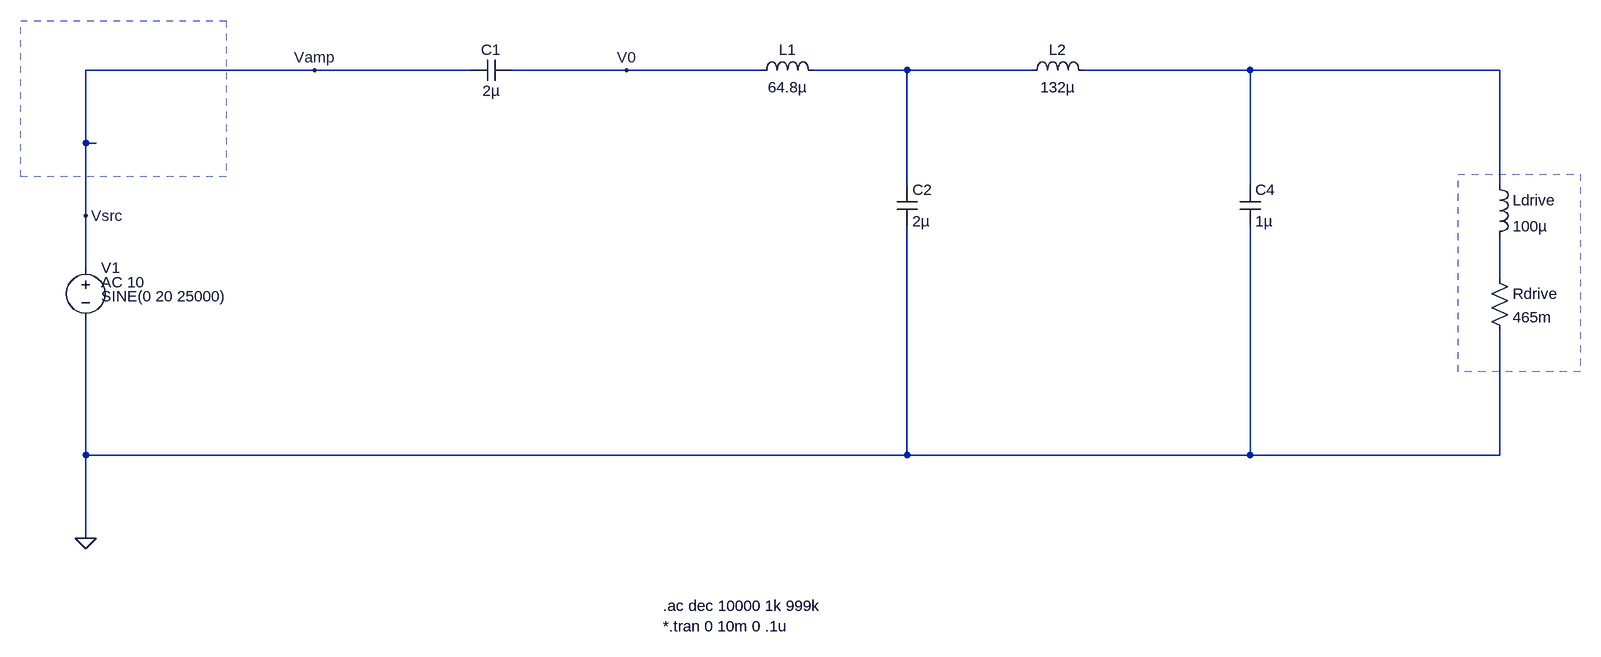
[diagram p0: schematic Tx_Filter_MPSv2_v2.asc]
Tx_Filter_MPSv2_v2.asc, the LTspice schematic file:
Version 4
SHEET 1 2128 1188
WIRE 176 64 -176 64
WIRE 416 64 176 64
WIRE 656 64 480 64
WIRE 864 64 656 64
WIRE 1088 64 944 64
WIRE 1280 64 1088 64
WIRE 1616 64 1360 64
WIRE 2000 64 1616 64
WIRE -176 176 -176 64
WIRE -160 176 -176 176
WIRE 1088 240 1088 64
WIRE 1616 240 1616 64
WIRE 2000 240 2000 64
WIRE -176 288 -176 176
WIRE -176 368 -176 288
WIRE 2000 384 2000 320
WIRE -176 656 -176 448
WIRE 1088 656 1088 304
WIRE 1088 656 -176 656
WIRE 1616 656 1616 304
WIRE 1616 656 1088 656
WIRE 2000 656 2000 464
WIRE 2000 656 1616 656
WIRE -176 784 -176 656
FLAG -176 288 Vsrc
FLAG 176 64 Vamp
FLAG 656 64 V0
FLAG -176 784 0
SYMBOL voltage -176 352 R0
WINDOW 123 24 38 Left 2
WINDOW 3 24 60 Left 2
WINDOW 39 0 0 Left 0
SYMATTR Value2 AC 10
SYMATTR Value SINE(0 20 25000)
SYMATTR InstName V1
SYMBOL res 1984 368 R0
SYMATTR InstName Rdrive
SYMATTR Value 465m
SYMBOL ind 1984 224 R0
SYMATTR InstName Ldrive
SYMATTR Value 100µ
SYMBOL ind 848 80 R270
WINDOW 0 32 56 VTop 2
WINDOW 3 5 56 VBottom 2
SYMATTR InstName L1
SYMATTR Value 64.8µ
SYMATTR SpiceLine Rser=.1472
SYMBOL ind 1264 80 R270
WINDOW 0 32 56 VTop 2
WINDOW 3 5 56 VBottom 2
SYMATTR InstName L2
SYMATTR Value 132µ
SYMATTR SpiceLine Rser=.3179
SYMBOL cap 480 48 R90
WINDOW 0 0 32 VBottom 2
WINDOW 3 32 32 VTop 2
SYMATTR InstName C1
SYMATTR Value 2µ
SYMBOL cap 1072 240 R0
SYMATTR InstName C2
SYMATTR Value 2µ
SYMBOL cap 1600 240 R0
SYMATTR InstName C4
SYMATTR Value 1µ
TEXT 712 888 Left 2 !.ac dec 10000 1k 999k\n*.tran 0 10m 0 .1u
RECTANGLE Normal -276 -12 40 228 2
RECTANGLE Normal 1936 224 2124 528 2

The netlist it stands for:
* Tx_Filter_MPSv2_v2.asc
V1 Vamp 0 SINE(0 20 25000) AC 10
Rdrive N003 0 465m
Ldrive N002 N003 100µ
L1 V0 N001 64.8µ Rser=.1472
L2 N001 N002 132µ Rser=.3179
C1 V0 Vamp 2µ
C2 N001 0 2µ
C4 N002 0 1µ
.ac dec 10000 1k 999k
*.tran 0 10m 0 .1u
.backanno
.end